# Altium schematic sheet [04] - CPU SIGNALS.SchDoc: CPU SIGNALS
size A4; Organization: Bjørn T. Brodtkorb; Address1: Frode Rinnans veg 161; Address2: 7050 Trondheim; DocumentNumber: 5; Revision: 1.0; SheetNumber: 5; SheetTotal: 13
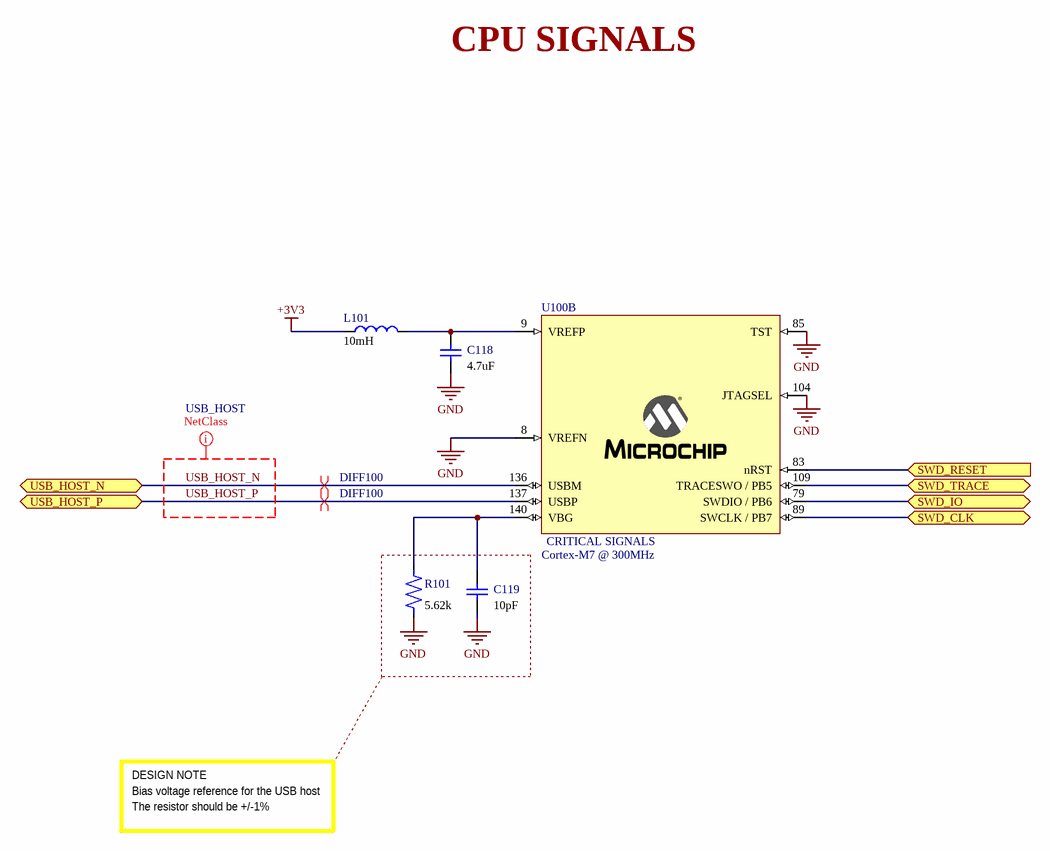
[diagram p0: [04] - CPU SIGNALS.SchDoc]

## Parts
C118  value 4.7uF  [C0402]  (hidden comment: 04023C103KAT2A)
C119  value 10pF  [C0402]  (hidden comment: 04023C103KAT2A)
L101  value 10mH  [Inductor 0603]  (hidden comment: MLZ1608A2R2WT)
R101  value 5.62k  [R0402]  (hidden comment: CRCW04020000Z0ED)
U100  Cortex-M7 @ 300MHz  [ATSAMS70Q21A-AN]  (part B of 4)

## Ports
SWD_CLK (bidir), SWD_IO (bidir), SWD_RESET (in), SWD_TRACE (bidir), USB_HOST_N (bidir), USB_HOST_P (bidir)

## Nets
+3V3: L101.1
GND: C118.1 C119.1 R101.1 U100.8(VREFN) U100.85(TST) U100.104(JTAGSEL)
SWD_CLK: U100.89(SWCLK_/_PB7) ; port SWD_CLK
SWD_IO: U100.79(SWDIO_/_PB6) ; port SWD_IO
SWD_RESET: U100.83(nRST) ; port SWD_RESET
SWD_TRACE: U100.109(TRACESWO_/_PB5) ; port SWD_TRACE
USB_HOST_N: U100.136(USBM) ; port USB_HOST_N
USB_HOST_P: U100.137(USBP) ; port USB_HOST_P
NetC118_2: C118.2 L101.2 U100.9(VREFP)
NetC119_2: C119.2 R101.2 U100.140(VBG)

## Layout directives
differential pair; differential pair class DIFF100: USB_HOST_N, USB_HOST_P
net class USB_HOST: USB_HOST_N, USB_HOST_P

## Notes on the sheet
- CPU SIGNALS
- DESIGN NOTE
- Bias voltage reference for the USB host
- The resistor should be +/-1%
- Title
- Size:
- Date:
- A4
- Number:
- Time:
- Revision:
- Sheet
- of
- StrawberryHacker
- File:
- (in symbol ATSAMS70Q21A-AN, part B) CRITICAL SIGNALS

## Library data of the parts
C118 C119 = 04023C103KAT2A: C0402
L101 = MLZ1608A2R2WT: Inductor 0603
R101 = CRCW04020000Z0ED: R0402
U100 = ATSAMS70Q21A-AN: ATSAMS70Q21; Supplier Part Number 1: 2484397; Supplier 1: Farnell